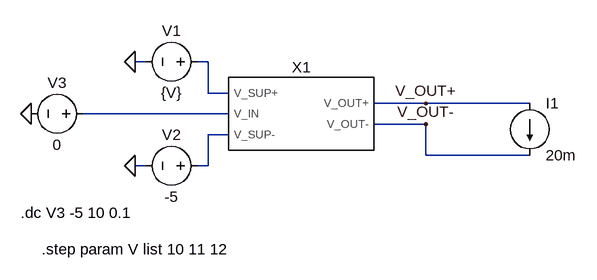
[diagram p0: schematic sim_bias.asc]
sim_bias.asc, the LTspice schematic file:
Version 4
SHEET 1 880 680
WIRE -64 80 -80 80
WIRE 32 80 16 80
WIRE 32 128 32 80
WIRE 64 128 32 128
WIRE 368 144 288 144
WIRE 528 144 368 144
WIRE 64 160 -160 160
WIRE 368 176 288 176
WIRE 64 192 32 192
WIRE 368 224 368 176
WIRE 528 224 368 224
WIRE -64 240 -80 240
WIRE 32 240 32 192
WIRE 32 240 16 240
FLAG -80 240 0
FLAG -80 80 0
FLAG -240 160 0
FLAG 368 144 V_OUT+
FLAG 368 176 V_OUT-
SYMBOL bias 176 160 R0
SYMATTR InstName X1
SYMBOL voltage 32 80 R90
WINDOW 0 -32 56 VBottom 2
WINDOW 3 32 56 VTop 2
WINDOW 123 0 0 Left 0
WINDOW 39 0 0 Left 0
SYMATTR InstName V1
SYMATTR Value {V}
SYMBOL voltage 32 240 R90
WINDOW 0 -32 56 VBottom 2
WINDOW 3 32 56 VTop 2
WINDOW 123 0 0 Left 0
WINDOW 39 0 0 Left 0
SYMATTR InstName V2
SYMATTR Value -5
SYMBOL voltage -144 160 R90
WINDOW 0 -32 56 VBottom 2
WINDOW 3 32 56 VTop 2
WINDOW 123 0 0 Left 0
WINDOW 39 0 0 Left 0
SYMATTR InstName V3
SYMATTR Value 0
SYMBOL current 528 144 R0
WINDOW 123 0 0 Left 0
WINDOW 39 0 0 Left 0
SYMATTR InstName I1
SYMATTR Value 20m
TEXT -256 312 Left 2 !.dc V3 -5 10 0.1
TEXT -224 368 Left 2 !.step param V list 10 11 12

The netlist it stands for:
* sim_bias.asc
XX1 N002 N001 N003 V_OUT+ V_OUT- bias  ; pins V_IN V_SUP+ V_SUP- V_OUT+ V_OUT-
V1 N001 0 {V}
V2 N003 0 -5
V3 N002 0 0
I1 V_OUT+ V_OUT- 20m
.dc V3 -5 10 0.1
.step param V list 10 11 12
.backanno
.end